# EAGLE design tappytap_v6_AoA_6x6 (EAGLE 7.3.0)
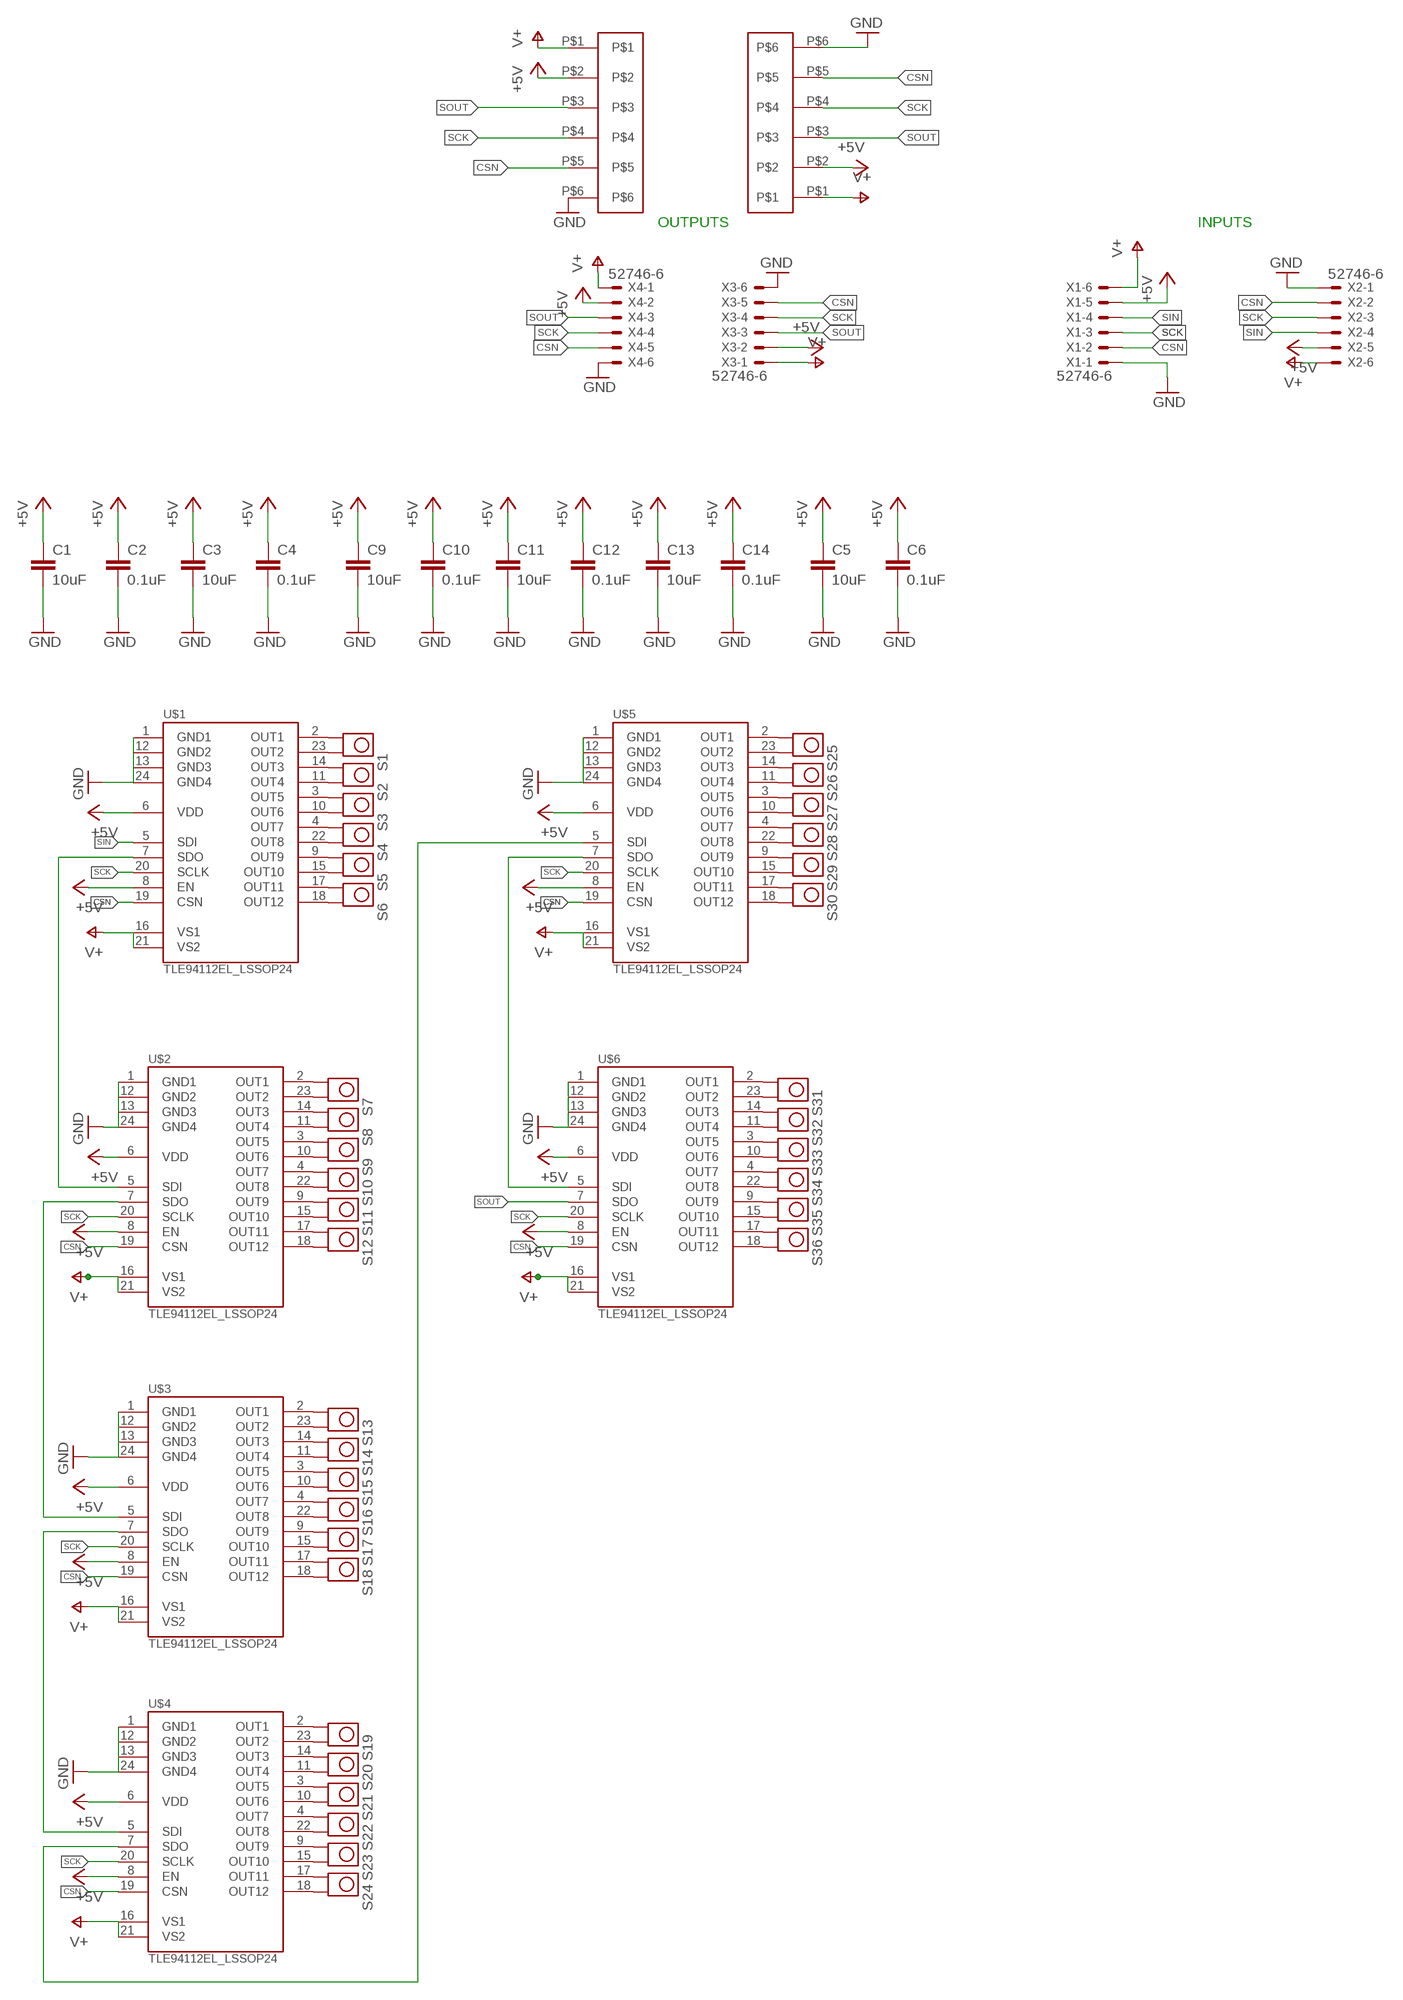
[diagram p0: schematic, sheet 1]

## Parts
C1  10uF  C-EUC0603  [C0603]
C2  0.1uF  C-EUC0603  [C0603]
C3  10uF  C-EUC0603  [C0603]
C4  0.1uF  C-EUC0603  [C0603]
C5  10uF  C-EUC0603  [C0603]
C6  0.1uF  C-EUC0603  [C0603]
C9  10uF  C-EUC0603  [C0603]
C10  0.1uF  C-EUC0603  [C0603]
C11  10uF  C-EUC0603  [C0603]
C12  0.1uF  C-EUC0603  [C0603]
C13  10uF  C-EUC0603  [C0603]
C14  0.1uF  C-EUC0603  [C0603]
S1  TP_4MM_MED_PAD  [TP_4MM_MED_PAD]
S2  TP_4MM_MED_PAD  [TP_4MM_MED_PAD]
S3  TP_4MM_MED_PAD  [TP_4MM_MED_PAD]
S4  TP_4MM_MED_PAD  [TP_4MM_MED_PAD]
S5  TP_4MM_MED_PAD  [TP_4MM_MED_PAD]
S6  TP_4MM_MED_PAD  [TP_4MM_MED_PAD]
S7  TP_4MM_MED_PAD  [TP_4MM_MED_PAD]
S8  TP_4MM_MED_PAD  [TP_4MM_MED_PAD]
S9  TP_4MM_MED_PAD  [TP_4MM_MED_PAD]
S10  TP_4MM_MED_PAD  [TP_4MM_MED_PAD]
S11  TP_4MM_MED_PAD  [TP_4MM_MED_PAD]
S12  TP_4MM_MED_PAD  [TP_4MM_MED_PAD]
S13  TP_4MM_MED_PAD  [TP_4MM_MED_PAD]
S14  TP_4MM_MED_PAD  [TP_4MM_MED_PAD]
S15  TP_4MM_MED_PAD  [TP_4MM_MED_PAD]
S16  TP_4MM_MED_PAD  [TP_4MM_MED_PAD]
S17  TP_4MM_MED_PAD  [TP_4MM_MED_PAD]
S18  TP_4MM_MED_PAD  [TP_4MM_MED_PAD]
S19  TP_4MM_MED_PAD  [TP_4MM_MED_PAD]
S20  TP_4MM_MED_PAD  [TP_4MM_MED_PAD]
S21  TP_4MM_MED_PAD  [TP_4MM_MED_PAD]
S22  TP_4MM_MED_PAD  [TP_4MM_MED_PAD]
S23  TP_4MM_MED_PAD  [TP_4MM_MED_PAD]
S24  TP_4MM_MED_PAD  [TP_4MM_MED_PAD]
S25  TP_4MM_MED_PAD  [TP_4MM_MED_PAD]
S26  TP_4MM_MED_PAD  [TP_4MM_MED_PAD]
S27  TP_4MM_MED_PAD  [TP_4MM_MED_PAD]
S28  TP_4MM_MED_PAD  [TP_4MM_MED_PAD]
S29  TP_4MM_MED_PAD  [TP_4MM_MED_PAD]
S30  TP_4MM_MED_PAD  [TP_4MM_MED_PAD]
S31  TP_4MM_MED_PAD  [TP_4MM_MED_PAD]
S32  TP_4MM_MED_PAD  [TP_4MM_MED_PAD]
S33  TP_4MM_MED_PAD  [TP_4MM_MED_PAD]
S34  TP_4MM_MED_PAD  [TP_4MM_MED_PAD]
S35  TP_4MM_MED_PAD  [TP_4MM_MED_PAD]
S36  TP_4MM_MED_PAD  [TP_4MM_MED_PAD]
U$1  TLE94112EL_LSSOP24  [SSOP-24]
U$2  TLE94112EL_LSSOP24  [SSOP-24]
U$3  TLE94112EL_LSSOP24  [SSOP-24]
U$4  TLE94112EL_LSSOP24  [SSOP-24]
U$5  TLE94112EL_LSSOP24  [SSOP-24]
U$6  TLE94112EL_LSSOP24  [SSOP-24]
U$15  FLEXTAB_6POS  [FLEXTAB_6POS]
U$16  FLEXTAB_6POS  [FLEXTAB_6POS]
X1  52746-6  [52746-6]
X2  52746-6  [52746-6]
X3  52746-6  [52746-6]
X4  52746-6  [52746-6]

## Nets
+5V [usbvcc]: C1.1 C2.1 C3.1 C4.1 C5.1 C6.1 C9.1 C10.1 C11.1 C12.1 C13.1 C14.1 U$1.6(VDD) U$1.8(EN) U$2.6(VDD) U$2.8(EN) U$3.6(VDD) U$3.8(EN) U$4.6(VDD) U$4.8(EN) U$5.6(VDD) U$5.8(EN) U$6.6(VDD) U$6.8(EN) U$15.P$2 U$16.P$2 X1.5 X2.5 X3.2 X4.2
CSN: U$1.19(CSN) U$2.19(CSN) U$3.19(CSN) U$4.19(CSN) U$5.19(CSN) U$6.19(CSN) U$15.P$5 U$16.P$5 X1.2 X2.2 X3.5 X4.5
GND [gnd]: C1.2 C2.2 C3.2 C4.2 C5.2 C6.2 C9.2 C10.2 C11.2 C12.2 C13.2 C14.2 U$1.1(GND1) U$1.12(GND2) U$1.13(GND3) U$1.24(GND4) U$2.1(GND1) U$2.12(GND2) U$2.13(GND3) U$2.24(GND4) U$3.1(GND1) U$3.12(GND2) U$3.13(GND3) U$3.24(GND4) U$4.1(GND1) U$4.12(GND2) U$4.13(GND3) U$4.24(GND4) U$5.1(GND1) U$5.12(GND2) U$5.13(GND3) U$5.24(GND4) U$6.1(GND1) U$6.12(GND2) U$6.13(GND3) U$6.24(GND4) U$15.P$6 U$16.P$6 X1.1 X2.1 X3.6 X4.6
N$1: S19.P$1 U$4.2(OUT1)
N$2: U$3.7(SDO) U$4.5(SDI)
N$3: S19.P$2 U$4.23(OUT2)
N$4: S20.P$1 U$4.14(OUT3)
N$5: S20.P$2 U$4.11(OUT4)
N$6: S21.P$1 U$4.3(OUT5)
N$7: S1.P$1 U$1.2(OUT1)
N$8: S1.P$2 U$1.23(OUT2)
N$9: S2.P$1 U$1.14(OUT3)
N$10: S2.P$2 U$1.11(OUT4)
N$11: S3.P$1 U$1.3(OUT5)
N$12: S3.P$2 U$1.10(OUT6)
N$13: S4.P$1 U$1.4(OUT7)
N$14: S4.P$2 U$1.22(OUT8)
N$15: S5.P$1 U$1.9(OUT9)
N$16: S5.P$2 U$1.15(OUT10)
N$17: S6.P$1 U$1.17(OUT11)
N$18: S6.P$2 U$1.18(OUT12)
N$19: S7.P$1 U$2.2(OUT1)
N$20: S7.P$2 U$2.23(OUT2)
N$21: S8.P$1 U$2.14(OUT3)
N$22: S8.P$2 U$2.11(OUT4)
N$23: S9.P$1 U$2.3(OUT5)
N$24: S21.P$2 U$4.10(OUT6)
N$25: S9.P$2 U$2.10(OUT6)
N$26: S22.P$1 U$4.4(OUT7)
N$27: S10.P$1 U$2.4(OUT7)
N$28: S10.P$2 U$2.22(OUT8)
N$29: S11.P$1 U$2.9(OUT9)
N$30: S11.P$2 U$2.15(OUT10)
N$31: S12.P$1 U$2.17(OUT11)
N$32: S12.P$2 U$2.18(OUT12)
N$33: S13.P$1 U$3.2(OUT1)
N$34: S13.P$2 U$3.23(OUT2)
N$35: S14.P$1 U$3.14(OUT3)
N$36: S14.P$2 U$3.11(OUT4)
N$37: S15.P$1 U$3.3(OUT5)
N$38: S15.P$2 U$3.10(OUT6)
N$39: S16.P$1 U$3.4(OUT7)
N$40: S16.P$2 U$3.22(OUT8)
N$41: S17.P$1 U$3.9(OUT9)
N$42: S17.P$2 U$3.15(OUT10)
N$43: S18.P$1 U$3.17(OUT11)
N$44: S18.P$2 U$3.18(OUT12)
N$45: U$2.7(SDO) U$3.5(SDI)
N$46: U$1.7(SDO) U$2.5(SDI)
N$47: S22.P$2 U$4.22(OUT8)
N$48: S23.P$1 U$4.9(OUT9)
N$49: S23.P$2 U$4.15(OUT10)
N$50: S24.P$1 U$4.17(OUT11)
N$51: S24.P$2 U$4.18(OUT12)
N$53: U$4.7(SDO) U$5.5(SDI)
N$54: S25.P$1 U$5.2(OUT1)
N$55: S25.P$2 U$5.23(OUT2)
N$56: S26.P$1 U$5.14(OUT3)
N$57: S26.P$2 U$5.11(OUT4)
N$58: S27.P$1 U$5.3(OUT5)
N$59: S27.P$2 U$5.10(OUT6)
N$60: S28.P$1 U$5.4(OUT7)
N$61: S28.P$2 U$5.22(OUT8)
N$62: S29.P$1 U$5.9(OUT9)
N$63: S29.P$2 U$5.15(OUT10)
N$64: S30.P$1 U$5.17(OUT11)
N$65: S30.P$2 U$5.18(OUT12)
N$66: S31.P$1 U$6.2(OUT1)
N$67: S31.P$2 U$6.23(OUT2)
N$68: S32.P$1 U$6.14(OUT3)
N$69: S32.P$2 U$6.11(OUT4)
N$70: S33.P$1 U$6.3(OUT5)
N$71: S33.P$2 U$6.10(OUT6)
N$72: S34.P$1 U$6.4(OUT7)
N$73: S34.P$2 U$6.22(OUT8)
N$74: S35.P$1 U$6.9(OUT9)
N$75: S35.P$2 U$6.15(OUT10)
N$76: S36.P$1 U$6.17(OUT11)
N$77: S36.P$2 U$6.18(OUT12)
N$90: U$5.7(SDO) U$6.5(SDI)
SCK: U$1.20(SCLK) U$2.20(SCLK) U$3.20(SCLK) U$4.20(SCLK) U$5.20(SCLK) U$6.20(SCLK) U$15.P$4 U$16.P$4 X1.3 X2.3 X3.4 X4.4
SIN: U$1.5(SDI) X1.4 X2.4
SOUT: U$6.7(SDO) U$15.P$3 U$16.P$3 X3.3 X4.3
V+: U$1.16(VS1) U$1.21(VS2) U$2.16(VS1) U$2.21(VS2) U$3.16(VS1) U$3.21(VS2) U$4.16(VS1) U$4.21(VS2) U$5.16(VS1) U$5.21(VS2) U$6.16(VS1) U$6.21(VS2) U$15.P$1 U$16.P$1 X1.6 X2.6 X3.1 X4.1

## Notes on the sheet
- OUTPUTS | INPUTS

## Library data of the parts
C1-C6 C9-C14 = rcl:C-EU: CAPACITOR, European symbol
S1-S36 = tom-tap:TP_4MM_MED_PAD
U$1-U$6 = tom-tap:TLE94112EL_LSSOP24
U$15 U$16 = tom-tap:FLEXTAB_6POS
X1-X4 = con-molex:52746-6: FPC Connector ZIF for SMT 0.5mm Source: http://www.farnell.com/datasheets/73044.pdf [DWG. NO. (Sheet 1 OF 2) SD-52746-**17]; OC_FARNELL: unknown; OC_NEWARK: unknown

## Board
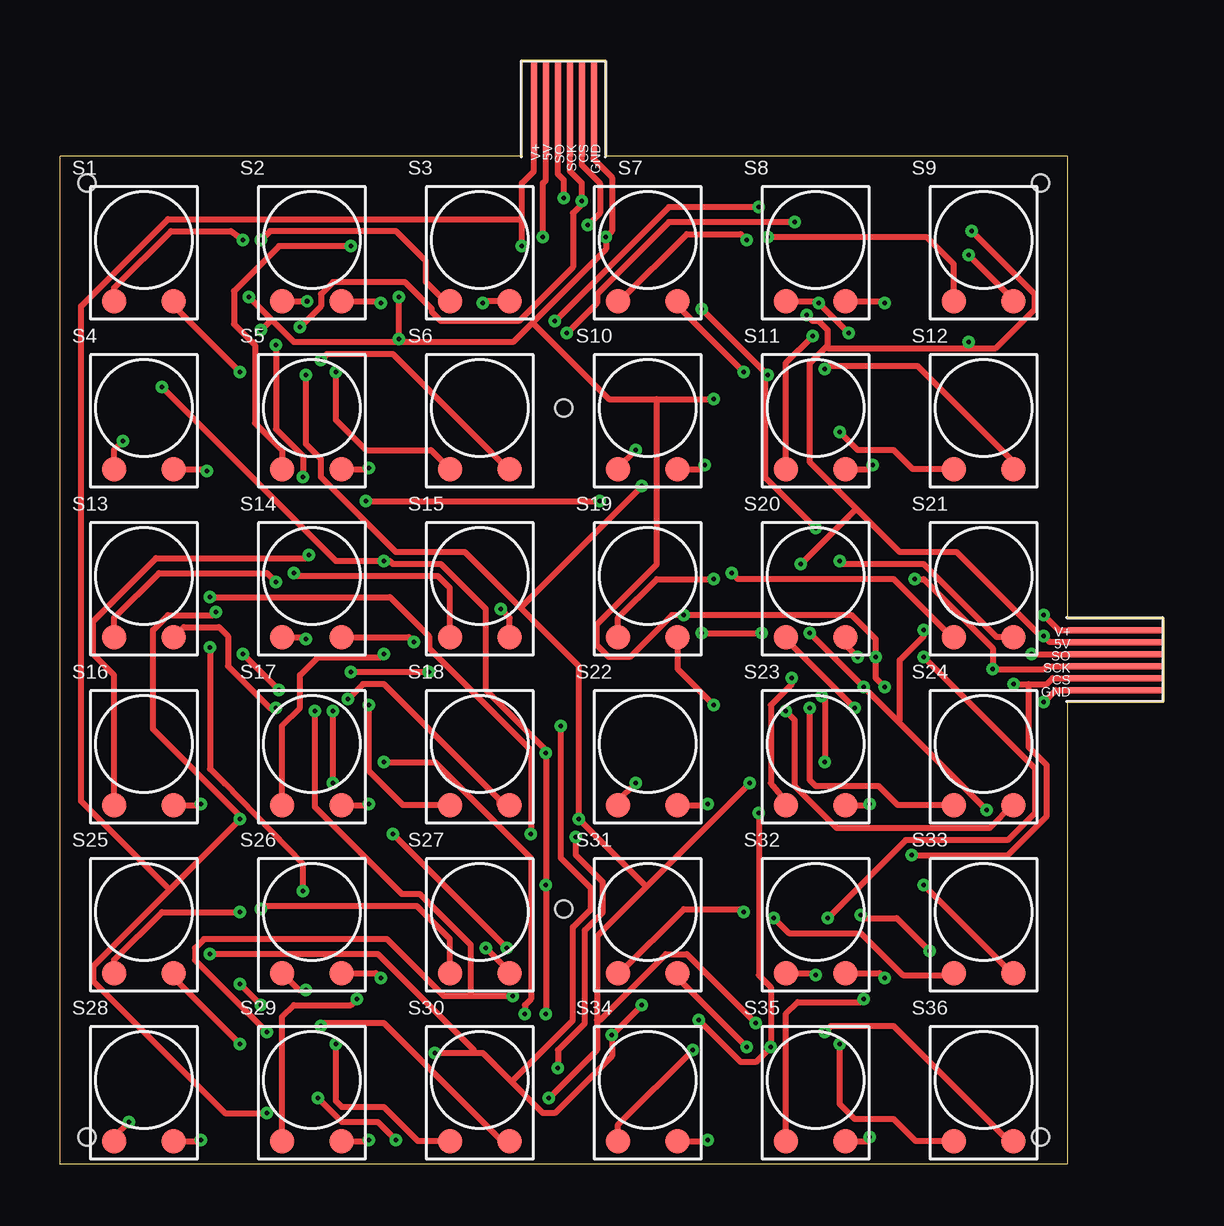
[diagram p1: board, top side]
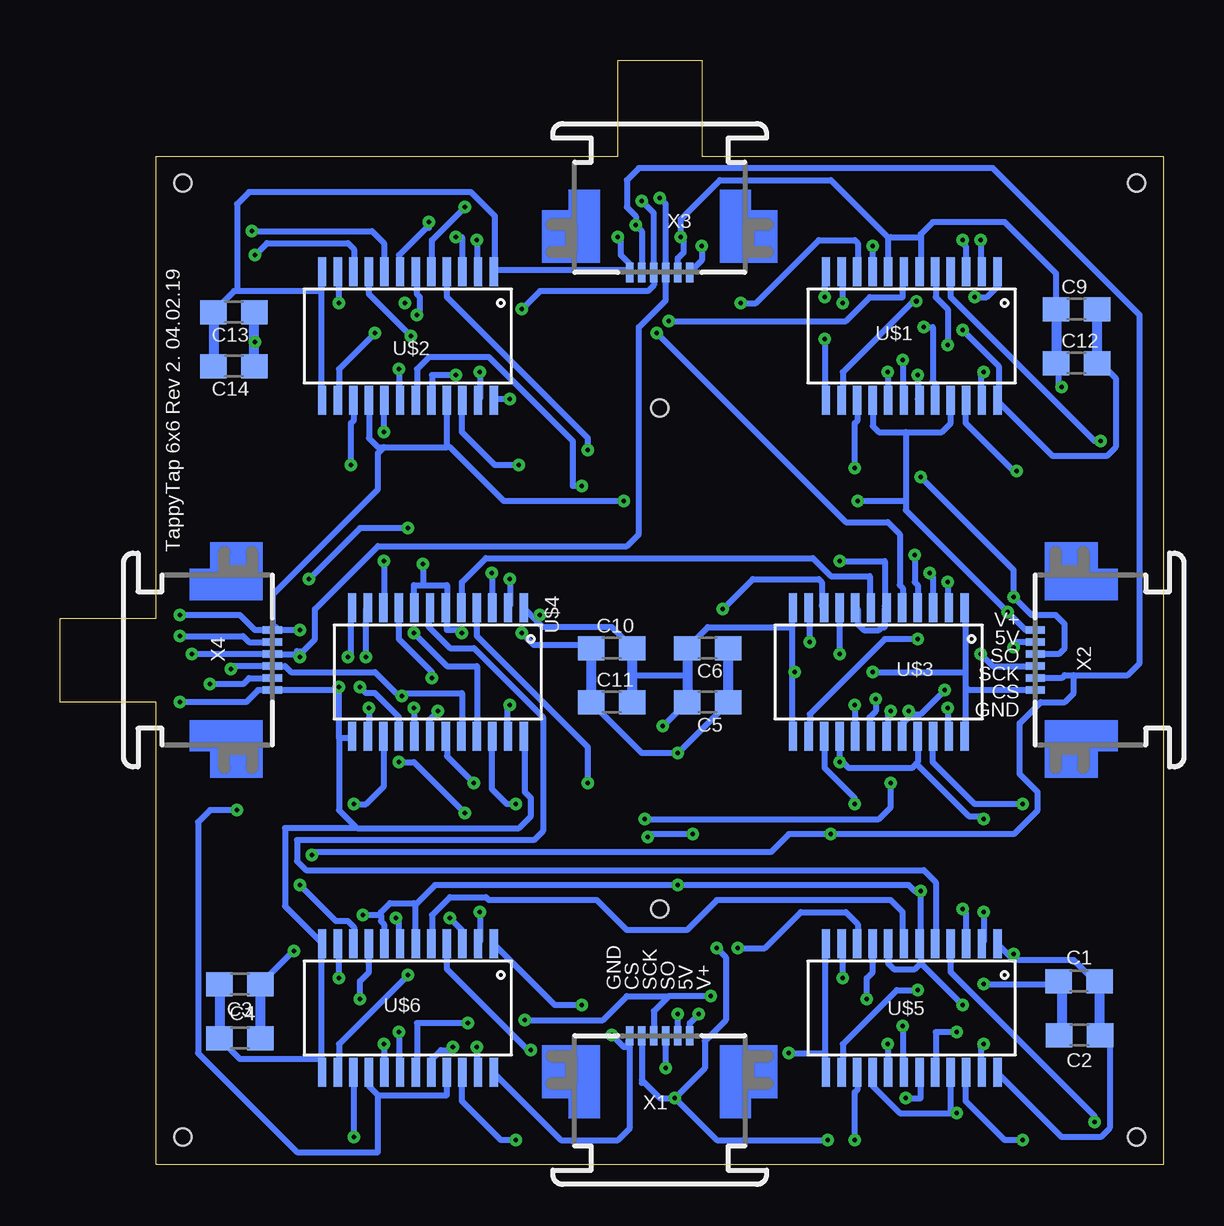
[diagram p2: board, bottom side, seen from below]

Size 46 x 46 mm. Coordinates in mm from the lower left corner, seen from the top.
Outline: 0,0 0,42 19.25,42 19.25,46 22.75,46 22.75,42 42,42 42,22.75 46,22.75 46,19.25 42,19.25 42,0 0,0
Copper layers (1*16): Top 0.035mm / dielectric 1.6mm / Bottom 0.035mm
Design rules "PCBWay *": minimum track width 8mil, minimum drill 0.2mm, track to track 6mil, track to pad 6mil, pad to pad 6mil, via to via 6mil, smd to smd 6mil, copper to edge 10mil, drill to drill 8mil, minimum pad ring 12mil, minimum via ring 6mil, stop-mask expansion 4mil, vias tented up to drill 25mil, thermal gap 10mil
Holes 0.7 mm at 1.12,40.88 40.88,40.88 40.88,1.12 1.12,1.12 21,31.5 21,10.62

### Footprints (pad centres in the part's own frame; a part is rotated, then mirrored left to right if it is on the bottom)
C0603 = smd 1.1 x 1: 1 -0.85,0; 2 0.85,0
TP_4MM_MED_PAD = smd 1.016 x 1.016: P$1 -1.24,-2.55; P$2 1.24,-2.55
SSOP-24 = smd 1.2 x 0.35: 1 -2.68,3.575; 2 -2.68,2.925; 3 -2.68,2.275; 4 -2.68,1.625; 5 -2.68,0.975; 6 -2.68,0.325; 7 -2.68,-0.325; 8 -2.68,-0.975; 9 -2.68,-1.625; 10 -2.68,-2.275; 11 -2.68,-2.925; 12 -2.68,-3.575; 13 2.68,-3.575; 14 2.68,-2.925; 15 2.68,-2.275; 16 2.68,-1.625; 17 2.68,-0.975; 18 2.68,-0.325; 19 2.68,0.325; 20 2.68,0.975; 21 2.68,1.625; 22 2.68,2.275; 23 2.68,2.925; 24 2.68,3.575
FLEXTAB_6POS = smd 0.25 x 4: P$1 -1.25,2; P$2 -0.75,2; P$3 -0.25,2; P$4 0.25,2; P$5 0.75,2; P$6 1.25,2
52746-6 = smd 0.3 x 0.8: 1 -1.25,0.6; 2 -0.75,0.6; 3 -0.25,0.6; 4 0.25,0.6; 5 0.75,0.6; 6 1.25,0.6

### Placement (x,y rotation side)
C1  3.52,7.62 0 bottom
C2  3.5,5.38 0 bottom
C3  38.5,7.5 180 bottom
C4  38.5,5.25 180 bottom
C5  19,19.25 180 bottom
C6  19,21.5 180 bottom
C9  3.62,35.62 0 bottom
C10  23,21.5 0 bottom
C11  23,19.25 0 bottom
C12  3.62,33.38 0 bottom
C13  38.75,35.5 180 bottom
C14  38.75,33.25 180 bottom
S1  3.5,38.5 0 top
S2  10.5,38.5 0 top
S3  17.5,38.5 0 top
S4  3.5,31.5 0 top
S5  10.5,31.5 0 top
S6  17.5,31.5 0 top
S7  24.5,38.5 0 top
S8  31.5,38.5 0 top
S9  38.5,38.5 0 top
S10  24.5,31.5 0 top
S11  31.5,31.5 0 top
S12  38.5,31.5 0 top
S13  3.5,24.5 0 top
S14  10.5,24.5 0 top
S15  17.5,24.5 0 top
S16  3.5,17.5 0 top
S17  10.5,17.5 0 top
S18  17.5,17.5 0 top
S19  24.5,24.5 0 top
S20  31.5,24.5 0 top
S21  38.5,24.5 0 top
S22  24.5,17.5 0 top
S23  31.5,17.5 0 top
S24  38.5,17.5 0 top
S25  3.5,10.5 0 top
S26  10.5,10.5 0 top
S27  17.5,10.5 0 top
S28  3.5,3.5 0 top
S29  10.5,3.5 0 top
S30  17.5,3.5 0 top
S31  24.5,10.5 0 top
S32  31.5,10.5 0 top
S33  38.5,10.5 0 top
S34  24.5,3.5 0 top
S35  31.5,3.5 0 top
S36  38.5,3.5 0 top
U$1  10.5,34.5 270 bottom
U$2  31.5,34.5 270 bottom
U$3  11.88,20.5 270 bottom
U$4  30.25,20.5 270 bottom
U$5  10.5,6.5 270 bottom
U$6  31.5,6.5 270 bottom
U$15  21,42 0 top
U$16  42,21 270 top
X1  21,4.75 0 bottom
X2  4.75,21 90 bottom
X3  21,37.75 180 bottom
X4  37.75,21 270 bottom

### Tracks (layer width: path | path; a pad name or v marks a point on that pad's centre or on a via)
+5V  (via drill 0.2, 0.2 pad 0.1)
  Top 0.254: v20.12,38.62 20.12,40.88 20.25,41 U$15.P$2 20.25,43.81 | U$16.P$2 41.25,21.75 v41,22 40.88,22 37.38,25.5 35,25.5 33.19,27.31 | v10.12,11.38 10.12,12.5 6.86,15.86 6.25,16.47 v6.25,21.52 | v8.38,6.62 v7.5,7.5 | v31.12,35.38 31.38,35.12 31.62,35.12 32,34.75 32,34.12 | 32,34.12 31.25,33.38 31.25,29.25 33.19,27.31 | v38,38.88 40.62,36.25 40.62,35.62 39,34 37.88,34 | 37.88,34 32,34 32,34.12 | 33.19,27.31 v30.88,25 | v37.88,34.25 37.88,34 | v20.25,6.25 v20.25,11.62 v20.25,17.12 20.25,17.25 17.75,19.75 17.75,23.12 15.88,25 13.88,25 13.75,25.12 v13.5,25.12 11.5,25.12 v4.25,32.38 | v26.75,22.12 v29.25,22.12 | v33.38,10.38 33.38,10.25 34.88,10.25 v36.25,8.88
  Bottom 0.254: v41,22 38.38,22 38.12,21.75 X4.2 | X3.2 20.25,37.75 20,38 20,38.5 v20.12,38.62 20.12,39.38 18.5,41 13.88,41 11.5,38.62 11.38,38.62 | C9.1 4.47,37.1 6.62,39.25 9.62,39.25 10.12,38.75 10.12,38.62 | 10.12,38.62 10.12,37.23 U$1.6 | U$1.8 11.47,38.52 11.38,38.62 | 11.38,38.62 10.12,38.62 | 31.25,10.88 32.25,10.88 32.62,10.5 32.62,10.38 | 31.25,10.88 31.12,10.88 30.38,11.62 v20.25,11.62 10.62,11.62 10.38,11.38 v10.12,11.38 10.12,9.25 U$5.6 10.12,9.12 10.12,8.38 | 32.62,10.38 v33.38,10.38 | v7.5,7.5 4.5,7.5 C1.1 | 10.12,8.38 v8.38,6.62 | 30.88,24.12 29.88,24.12 29.88,23.25 U$4.6 29.88,23.12 29.88,22.25 29.38,22.25 v29.25,22.12 | 30.88,24.12 31.25,24.12 31.25,23.25 U$4.8 | v31.12,35.38 31,35.38 31,36.12 31.12,36.25 31.12,37.12 U$2.6 | v38,38.88 33,38.88 32.5,38.38 32.5,37.25 U$2.8 | v30.88,25 30.88,24.12 | v37.88,34.25 37.9,34.25 | U$3.8 12.75,23.12 12.75,22.5 12.5,22.25 11.88,22.25 11.75,22.38 11.62,22.38 11.62,23.12 U$3.6 11.62,23.25 11.62,25.12 v13.5,25.12 | C5.1 18.25,19.12 v20.25,17.12 21.75,17.12 23.75,19.12 C11.1 | v4.25,32.38 4.38,32.38 4.38,33.25 C12.1 | v26.75,22.12 26.25,21.62 24,21.62 C10.1 | U$5.8 11.47,8.35 11.25,8.12 10.38,8.12 10.12,8.38 | 37.15,8 C3.1 36.27,8.88 v36.25,8.88 | U$6.6 31.18,10.8 31.25,10.88 | 32.62,10.38 32.62,10.12 32.5,10 32.5,9.21 U$6.8 | X1.5 v20.25,6.25 | X2.5 6.15,21.75 v6.25,21.52
  Bottom 0.406: C9.1 C12.1 | C14.1 37.9,34.25 C13.1 | C6.1 C5.1 | C11.1 C10.1 | C3.1 C4.1 | C1.1 4.25,7.62 4.25,5.47 C2.1
CSN  (via drill 0.2, 0.2 pad 0.1)
  Top 0.254: v10.75,2.75 11.75,1.75 13.25,1.75 v14,1 | v20.38,2.75 22.38,4.75 22.38,6 | 22.38,6 22.38,9.5 24.44,11.56 | v28.75,15.88 24.44,11.56 | v11.38,15.88 v11.38,18.88 | 24.44,11.56 v21.62,14.38 21.62,20.75 19.19,23.19 | v10.25,32.88 10.25,30 10.88,29.38 10.88,28.62 14,25.5 16.88,25.5 19.19,23.19 | v29,5.88 26.12,8.75 25.25,8.75 22.5,6 22.38,6 | 19.19,23.19 v24.25,28.25 | v22,39.12 22.5,39.62 22.5,40.88 21.75,41.62 U$15.P$5 21.75,43.88 | v39.75,20 40.38,20 | 40.38,20 41.12,20 41.38,20.25 U$16.P$5 | v13.88,13.75 v18.62,9 | 40.38,20 40.38,17.38 41.12,16.62 41.12,14.5 39.5,12.88 v35.5,12.88
  Bottom 0.254: v10.75,2.75 10.12,2.75 10.12,3.75 U$5.19 | v14,1 18.62,1 v20.38,2.75 | v28.75,15.88 29.88,17 29.88,17.75 U$4.19 | v11.38,18.88 11.5,18.88 11.5,17.88 U$3.19 | v21.62,14.38 11.88,14.38 11.38,14.88 v11.38,15.88 | v10.25,32.88 10.25,31.88 U$1.19 | v29,5.88 31.12,5.88 31.12,3.88 U$6.19 | v24.25,28.25 24.62,28.25 24.62,30.12 28.12,33.62 30.62,33.62 31.12,33.12 31.12,31.88 U$2.19 | v39.75,20 38.38,20 38.12,20.25 X4.5 | v18.62,9 18.25,8.62 18.25,6 19.12,5.12 19.12,4 v20.38,2.75 | v35.5,12.88 35.38,13 16.38,13 15.62,13.75 v13.88,13.75 6.25,13.75 5.25,14.75 5.25,15.5 6,16.25 6,18.38 5.12,19.25 4.12,19.25 3.75,19.62 3.75,20.38 | 3.75,20.38 4.12,20.38 4.25,20.25 X2.2 | 3.75,20.38 1.5,20.38 1,20.88 1,35.38 7.12,41.5 21.88,41.5 22.38,41 22.38,39.88 22,39.5 v22,39.12 21.75,38.88 X3.5 | X1.2 21.75,3.5 | 21.75,3.5 21.75,3.38 | 21.75,3.5 21,2.75 v20.38,2.75
GND  (via drill 0.2, 0.2 pad 0.1)
  Top 0.254: U$15.P$6 22.23,41.9 23,41.12 23,38.88 v22.75,38.62 22.75,38.12 19.69,35.06 | U$16.P$6 41.5,19.75 v41,19.25 | 8.81,35.19 9.75,34.25 14.12,34.25 | 8.81,35.19 v7.88,36.12 | 14.12,34.25 18.88,34.25 19.69,35.06 | 14.12,34.25 v14.12,34.38 v14.12,36.12 | 24.88,31.88 22.88,31.88 19.69,35.06 | 24.88,31.88 v27.25,31.88 | 8.81,35.19 v8.38,34.75 | v24.25,6.62 v23,5.38 23,4.5 20.62,2.12 20.12,2.12 18.81,3.44 | 17.25,4.62 17.62,4.62 18.81,3.44 | 17.25,4.62 v15.62,4.62 | v6.25,8.75 13.25,8.75 17.25,4.75 17.25,4.62 | v15.38,20.5 v12.12,20.5 | v34.38,19.88 34,20.25 v34,21.12 34,21.88 33,22.88 v26,22.88 25.5,22.88 23.75,21.12 22.88,21.12 22.38,21.62 22.38,22.5 24.88,25 24.88,31.88 | 18.81,3.44 21.38,6 21.38,9.88 22.12,10.62 22.12,11.5 20.88,12.75 v20.88,18.25
  Bottom 0.254: v41,19.25 38.25,19.25 37.75,19.75 X4.6 34.5,19.75 v34.38,19.88 34.38,17.75 | v22.75,38.62 22.62,38.5 22.62,37.88 22.25,37.5 X3.6 22.38,37.25 27.88,37.25 U$2.1 27.88,37.38 27.88,39.5 28.88,40.5 38.12,40.5 38.62,40 38.62,36.38 | 35.12,36.38 35.12,37.12 U$2.12 | 35.12,36.38 35.12,31.88 U$2.13 | 35.12,36.38 38.62,36.38 | 38.62,36.38 38.75,36.38 39.5,35.62 C13.2 | C12.2 2.62,33.25 2.5,33.25 2,32.75 2,29.88 2.38,29.5 4.62,29.5 6.88,31.75 U$1.24 6.88,31.88 6.88,33.25 v8.38,34.75 | v7.88,36.12 7.38,36.12 6.88,36.62 6.88,37.12 U$1.1 | v14.12,34.38 14.12,31.88 U$1.13 | v14.12,36.12 14.12,37.12 U$1.12 | v27.25,31.88 27.88,31.88 U$2.24 | U$5.24 6.88,3.75 4.25,1.12 2.62,1.12 2.25,1.5 2.25,5.25 2.5,5.25 C2.2 | 6.44,8.69 6.25,8.5 3.75,8.5 2.88,7.62 C1.2 | 6.44,8.69 6.88,9.12 U$5.1 | 14.12,4.62 14.12,9.12 U$5.12 | 14.12,4.62 14.12,3.88 U$5.13 | U$6.24 27.88,3.75 25.12,1 22.75,1 22.25,1.5 X1.1 22.38,4.88 22.5,4.88 v23,5.38 | v24.25,6.62 25.38,6.62 27.88,9.12 U$6.1 | v15.62,4.62 14.12,4.62 | v6.25,8.75 6.38,8.75 6.44,8.69 | 8.25,17.88 U$3.24 8.25,18 8.25,19.88 | 8.25,19.88 8.25,20.5 | 8.25,20.5 8.25,23.12 U$3.1 | 15.5,22.38 15.5,23.12 U$3.12 | 15.5,22.38 15.5,20.5 | 15.5,20.5 15.5,17.88 U$3.13 | 26.19,22.69 25.88,22.38 23,22.38 22.25,21.62 C10.2 | 26.19,22.69 26.62,23.12 U$4.1 | 22.15,20.38 19.85,20.38 | 15.5,22.38 19,22.38 19.75,21.62 C6.2 | v12.12,20.5 8.25,20.5 | v15.38,20.5 15.5,20.5 | C4.2 39.25,5.12 38.5,4.38 35.12,4.38 U$6.13 35.12,3.88 35.12,9.12 U$6.12 35.12,9.25 36.62,10.75 36.62,14 33.62,14 | 33.62,14 26.88,14 26.38,14.5 26.38,15.25 26.62,15.5 26.62,17.75 U$4.24 | 33.62,14 34.38,14.75 34.38,17.75
  Bottom 0.254: 34.38,17.75 33.88,17.75 U$4.13 | v34,21.12 33.88,21.12 33.88,23.12 U$4.12 | v26,22.88 26.19,22.69 | v20.88,18.25 20,19.12 C5.2 | X2.1 8.12,19.75 8.25,19.88
  Bottom 0.406: C9.2 C12.2 | C13.2 C14.2 | C6.2 19.85,20.38 C5.2 | C10.2 22.15,20.38 C11.2 | C3.2 C4.2 | C1.2 2.67,5.4 C2.2
N$1  (via drill 0.2)
  Top 0.254: S19.P$1 23.26,22.76 24.88,24.38 v27.25,24.38
  Bottom 0.254: v27.25,24.38 27.25,23.25 U$4.2
N$2
  Bottom 0.254: U$3.7 12.25,23.25 12.25,24.5 13.88,24.5 14.62,25.25 28.25,25.25 29.25,24.25 29.25,23.25 U$4.5
N$3  (via drill 0.2)
  Top 0.254: S19.P$2 25.74,20.64 v27.25,19.12
  Bottom 0.254: v27.25,19.12 27.38,19 27.38,17.87 U$4.23
N$4  (via drill 0.2)
  Top 0.254: S20.P$1 30.26,21.86 v33.12,19
  Bottom 0.254: v33.12,19 33.12,17.87 U$4.14
N$5  (via drill 0.2)
  Top 0.254: S20.P$2 32.74,21.64 v33.25,21.12
  Bottom 0.254: v33.25,21.12 33.25,23.11 U$4.11
N$6  (via drill 0.2)
  Top 0.254: S21.P$1 37.17,21.95 34.75,24.38 28.25,24.38 v28,24.62
  Bottom 0.254: v28,24.62 28,23.2 U$4.3
N$7  (via drill 0.2)
  Top 0.254: S1.P$1 2.26,36.51 4.62,38.88 7.12,38.88 v7.62,38.5
  Bottom 0.254: v7.62,38.5 7.62,37.26 U$1.2
N$8  (via drill 0.2)
  Top 0.254: S1.P$2 4.74,35.76 v7.5,33
  Bottom 0.254: v7.5,33 7.62,32.88 7.62,31.87 U$1.23
N$9  (via drill 0.2)
  Top 0.254: S2.P$1 v10.3,35.95
  Bottom 0.254: v10.3,35.95 10.43,35.95 13.38,33 13.38,31.87 U$1.14
N$10  (via drill 0.2)
  Top 0.254: S2.P$2 13.3,35.95 v13.38,35.88
  Bottom 0.254: v13.38,35.88 13.38,37.1 U$1.11
N$11  (via drill 0.2)
  Top 0.254: S3.P$1 16.05,35.95 15.25,36.75 15.25,37.62 14,38.88 8.75,38.88 v8.38,38.5
  Bottom 0.254: v8.38,38.5 8.38,38.38 8.25,38.25 8.25,37.2 U$1.3
N$12  (via drill 0.2)
  Top 0.254: S3.P$2 17.7,35.95 v17.62,35.88
  Bottom 0.254: v17.62,35.88 17,35.88 14.38,38.5 12.88,38.5 12.75,38.38 12.75,37.2 U$1.10
N$13  (via drill 0.2)
  Top 0.254: S4.P$1 2.26,29.76 v2.62,30.12
  Bottom 0.254: v2.62,30.12 2.88,30.12 8.88,36.12 U$1.4
N$14  (via drill 0.2)
  Top 0.254: S4.P$2 6.05,28.95 v6.12,28.88
  Bottom 0.254: U$1.22 8.25,31.8 8.25,30.88 6.25,28.88 v6.12,28.88
N$15  (via drill 0.2)
  Top 0.254: v12.12,38.25 9.12,38.25 7.25,36.38 7.25,35 8.12,34.12 8.12,30.88 9.25,29.75 9.25,29 S5.P$1
  Bottom 0.254: U$1.9 v12.12,38.25
N$16  (via drill 0.2)
  Top 0.254: S5.P$2 12.82,28.95 v12.88,29
  Bottom 0.254: v12.88,29 12.88,30.88 12.75,31 12.75,31.8 U$1.15
N$17  (via drill 0.2)
  Top 0.254: v11.5,33 11.5,31 12.75,29.75 15.46,29.75 S6.P$1
  Bottom 0.254: v11.5,33 11.5,31.84 U$1.17
N$18  (via drill 0.2)
  Top 0.254: S6.P$2 18.68,28.95 13.88,33.75 11.12,33.75 v10.88,33.5
  Bottom 0.254: v10.88,33.5 10.88,31.87 U$1.18
N$19  (via drill 0.2)
  Top 0.254: S7.P$1 23.32,35.95 26.12,38.75 28.38,38.75 v28.62,38.5
  Bottom 0.254: v28.62,38.5 28.62,37.23 U$2.2
N$20  (via drill 0.2)
  Top 0.254: S7.P$2 25.74,35.76 v28.5,33
  Bottom 0.254: v28.5,33 28.5,31.89 U$2.23
N$21  (via drill 0.2)
  Top 0.254: S8.P$1 31.55,35.95 v31.62,35.88 v32.88,34.62
  Bottom 0.254: v31.62,35.88 31.5,35.88 | U$2.14 34.38,31.87 34.38,33.12 v32.88,34.62
N$22  (via drill 0.2)
  Top 0.254: S8.P$2 34.42,35.95 v34.38,35.88
  Bottom 0.254: v34.38,35.88 34.38,37.1 U$2.11
N$23  (via drill 0.2)
  Top 0.254: S9.P$1 37.26,37.49 36.12,38.62 v29.5,38.62
  Bottom 0.254: v29.5,38.62 29.25,38.62 29.25,37.2 U$2.3
N$24  (via drill 0.2)
  Top 0.254: S21.P$2 39.05,21.95 36,25 32.62,25 v32.5,25.12
  Bottom 0.254: v32.5,25.12 32.5,23.2 U$4.10
N$25  (via drill 0.2)
  Top 0.254: S9.P$2 39.74,36.01 v37.88,37.88
  Bottom 0.254: v37.88,37.88 37.38,38.38 34,38.38 33.75,38.12 33.75,37.2 U$2.10
N$26  (via drill 0.2)
  Top 0.254: S22.P$1 23.26,15.13 v24,15.88
  Bottom 0.254: v24,15.88 24,17.38 28.62,22 U$4.4
N$27  (via drill 0.2)
  Top 0.254: S10.P$1 23.26,29.01 v24,29.75
  Bottom 0.254: v24,29.75 24,30.25 29.88,36.12 U$2.4
N$28  (via drill 0.2)
  Top 0.254: S10.P$2 26.7,28.95 v26.88,29.12
  Bottom 0.254: v26.88,29.12 27.88,29.12 29.25,30.5 29.25,31.8 U$2.22
N$29  (via drill 0.2)
  Top 0.254: S11.P$1 30.26,33.38 v31.38,34.5
  Bottom 0.254: v31.38,34.5 33.12,36.25 U$2.9
N$30  (via drill 0.2)
  Top 0.254: S11.P$2 33.7,28.95 v33.88,29.12
  Bottom 0.254: v33.88,29.12 33.88,30.88 33.75,31 33.75,31.8 U$2.15
N$31  (via drill 0.2)
  Top 0.254: S12.P$1 35.55,28.95 34.75,29.75 33.25,29.75 v32.5,30.5
  Bottom 0.254: v32.5,30.5 32.5,31.8 U$2.17
N$32  (via drill 0.2)
  Top 0.254: S12.P$2 39.74,29.26 35.75,33.25 32,33.25 v31.88,33.12
  Bottom 0.254: v31.88,33.12 31.88,31.87 U$2.18
N$33  (via drill 0.2)
  Top 0.254: S13.P$1 2.26,22.76 4.12,24.62 8.62,24.62 v9,24.25
  Bottom 0.254: v9,24.25 9,23.23 U$3.2
N$34  (via drill 0.2)
  Top 0.254: S13.P$2 5.17,22.38 6.62,22.38 7,22 7,20.75 8.75,19 v9,19
  Bottom 0.254: v9,19 9,17.87 U$3.23
N$35  (via drill 0.2)
  Top 0.254: S14.P$1 10.18,21.95 v10.25,21.88
  Bottom 0.254: v10.25,21.88 11.62,21.88 14.75,18.75 14.75,17.87 U$3.14
N$36  (via drill 0.2)
  Top 0.254: S14.P$2 14.55,21.95 v14.75,21.75
  Bottom 0.254: v14.75,21.75 14.75,23.13 U$3.11
N$37  (via drill 0.2)
  Top 0.254: S15.P$1 16.26,23.99 15.75,24.5 9.88,24.5 v9.75,24.62
  Bottom 0.254: v9.75,24.62 9.62,24.5 9.62,23.2 U$3.3
N$38  (via drill 0.2)
  Top 0.254: S15.P$2 18.74,22.76 v18.38,23.12
  Bottom 0.254: v18.38,23.12 17.12,24.38 14.38,24.38 14.25,24.25 14.25,23.28 U$3.10
N$39  (via drill 0.2)
  Top 0.254: S16.P$1 2.26,20.36 1.38,21.25 1.38,22.62 4,25.25 10.25,25.25 v10.38,25.38
  Bottom 0.254: v10.38,25.38 10.38,24.25 10.25,24.12 U$3.4
N$40  (via drill 0.2)
  Top 0.254: S16.P$2 5.83,14.95 v5.88,15
  Bottom 0.254: v5.88,15 7.88,15 9.62,16.75 9.62,17.8 U$3.22
N$41  (via drill 0.2)
  Top 0.254: S17.P$1 9.26,18.26 10,19 10,20.38 10.75,21.12 13.38,21.12 v13.5,21.25
  Bottom 0.254: v13.5,21.25 U$3.9
N$42  (via drill 0.2)
  Top 0.254: S17.P$2 12.82,14.95 v12.88,15
  Bottom 0.254: v12.88,15 12.88,15.25 14.12,16.5 14.12,17.8 U$3.15
N$43  (via drill 0.2)
  Top 0.254: S18.P$1 14.3,14.95 12.88,16.38 v12.88,19.12
  Bottom 0.254: v12.88,19.12 12.88,17.84 U$3.17
N$44  (via drill 0.2)
  Top 0.254: S18.P$2 18.32,14.95 18.32,15.18 13.5,20 12.62,20 v12,19.38
  Bottom 0.254: v12,19.38 12,18.88 12.25,18.62 12.25,17.87 U$3.18
N$45  (via drill 0.2)
  Top 0.254: v21.12,34.62 22.38,35.88 22.38,36.25 25.38,39.25 v30.62,39.25
  Bottom 0.254: v21.12,34.62 13.25,26.75 11.5,26.75 11,26.25 11,24.12 10.88,24 10.88,23.2 U$3.5 | v30.62,39.25 30.62,39 30.75,39 31.88,37.88 31.88,37.23 U$2.7
N$46  (via drill 0.2)
  Top 0.254: v20.62,35.12 25.38,39.88 v29.12,39.88
  Bottom 0.254: v20.62,35.12 13.25,35.12 12.25,36.12 10.88,36.12 10.88,37.12 U$1.7 | v29.12,39.88 30.5,38.5 30.5,37.25 U$2.5
N$47  (via drill 0.2)
  Top 0.254: S22.P$2 26.95,14.95 v27,15
  Bottom 0.254: v27,15 27.38,15 28,15.62 28,17.8 U$4.22
N$48  (via drill 0.2)
  Top 0.254: S23.P$1 30.26,15.12 29.62,15.88 29.62,19.12 30.5,20 v30.5,20.25
  Bottom 0.254: v30.5,20.25 30.5,20.5 31.88,21.88 U$4.9
N$49  (via drill 0.2)
  Top 0.254: S23.P$2 33.7,14.95 v33.75,15
  Bottom 0.254: v33.75,15 33.25,15 32.5,15.75 32.5,17.72 U$4.15
N$50  (via drill 0.2)
  Top 0.254: S24.P$1 34.92,14.95 34.12,15.75 31.5,15.75 31.25,16 v31.25,19
  Bottom 0.254: v31.25,19 31.25,17.84 U$4.17
N$51  (via drill 0.2)
  Top 0.254: S24.P$2 39.7,14.95 38.75,14 32.38,14 30.62,15.75 30.62,18.5 v30.25,18.88
  Bottom 0.254: v30.25,18.88 30.62,18.5 30.62,17.87 U$4.18
N$53
  Bottom 0.254: U$5.5 9.5,9.25 9.5,11.75 10,12.25 35.75,12.25 36.12,12.62 36.12,13.5 26.25,13.5 25.88,13.88 25.88,18.62 28.75,21.5 29.75,21.5 30.62,22.38 30.62,23.13 U$4.7
N$54  (via drill 0.2)
  Top 0.254: S25.P$1 2.26,8.51 4.25,10.5 v7.5,10.5
  Bottom 0.254: v7.5,10.5 7.5,9.26 U$5.2
N$55  (via drill 0.2)
  Top 0.254: S25.P$2 4.74,7.76 v7.5,5
  Bottom 0.254: v7.5,5 7.62,4.88 7.62,3.87 U$5.23
N$56  (via drill 0.2)
  Top 0.254: v10.25,7.25 9.96,7.25 S26.P$1
  Bottom 0.254: U$5.14 13.38,3.87 13.38,5 11.12,7.25 v10.25,7.25
N$57  (via drill 0.2)
  Top 0.254: S26.P$2 13.18,7.95 v13.38,7.75
  Bottom 0.254: v13.38,7.75 13.38,9.13 U$5.11
N$58  (via drill 0.2)
  Top 0.254: S27.P$1 16.26,9.37 14.88,10.75 8.5,10.75 v8.38,10.62
  Bottom 0.254: v8.38,10.62 8.25,10.5 8.25,9.21 U$5.3
N$59  (via drill 0.2)
  Top 0.254: S27.P$2 18.74,8.01 v17.75,9
  Bottom 0.254: v17.75,9 16.62,9 15.12,10.5 13.25,10.5 12.75,10 12.75,9.21 U$5.10
N$60  (via drill 0.2)
  Top 0.254: S28.P$1 2.26,1.14 v2.88,1.75
  Bottom 0.254: v2.88,1.75 2.88,2 8.88,8 U$5.4
N$61  (via drill 0.2)
  Top 0.254: S28.P$2 5.83,0.95 v5.88,1
  Bottom 0.254: v5.88,1 6.62,1 8.25,2.62 8.25,3.79 U$5.22
N$62  (via drill 0.2)
  Top 0.254: S29.P$1 9.26,6.13 9.75,6.62 12.12,6.62 v12.38,6.88
  Bottom 0.254: v12.38,6.88 12.38,7.75 12.12,8 U$5.9
N$63  (via drill 0.2)
  Top 0.254: S29.P$2 12.82,0.95 v12.88,1
  Bottom 0.254: v12.88,1 12.88,3 12.75,3.12 12.75,3.79 U$5.15
N$64  (via drill 0.2)
  Top 0.254: S30.P$1 14.93,0.95 13.5,2.38 11.75,2.38 11.5,2.62 v11.5,5
  Bottom 0.254: v11.5,5 11.5,3.85 U$5.17
N$65  (via drill 0.2)
  Top 0.254: S30.P$2 18.43,0.95 13.5,5.88 11,5.88 v10.88,5.75
  Bottom 0.254: v10.88,5.75 10.88,3.87 U$5.18
N$66  (via drill 0.2)
  Top 0.254: S31.P$1 23.32,7.95 26,10.62 28.38,10.62 v28.5,10.5
  Bottom 0.254: v28.5,10.5 28.5,9.26 U$6.2
N$67  (via drill 0.2)
  Top 0.254: S31.P$2 25.74,7.76 v28.62,4.88
  Bottom 0.254: v28.62,4.88 28.62,3.87 U$6.23
N$68  (via drill 0.2)
  Top 0.254: S32.P$1 31.43,7.95 v31.5,7.88
  Bottom 0.254: v31.5,7.88 34.38,5 34.38,3.87 U$6.14
N$69  (via drill 0.2)
  Top 0.254: S32.P$2 34.17,7.95 v34.38,7.75
  Bottom 0.254: v34.38,7.75 34.38,9.13 U$6.11
N$70  (via drill 0.2)
  Top 0.254: v29.75,10.25 30.38,9.62 33.38,9.62 35.12,7.88 37.25,7.88 S33.P$1
  Bottom 0.254: v29.75,10.25 29.25,9.75 29.25,9.25 U$6.3
N$71  (via drill 0.2)
  Top 0.254: v36,11.62 39.62,8 39.69,8 S33.P$2
  Bottom 0.254: v36,11.62 34.5,10.12 34,10.12 33.75,9.88 33.75,9.21 U$6.10
N$72  (via drill 0.2)
  Top 0.254: S34.P$1 23.26,1.64 v26.38,4.75
  Bottom 0.254: v26.38,4.75 26.5,4.75 29.88,8.12 U$6.4
N$73  (via drill 0.2)
  Top 0.254: S34.P$2 26.95,0.95 v27,1
  Bottom 0.254: v27,1 27.62,1 29.25,2.62 29.25,3.79 U$6.22
N$74  (via drill 0.2)
  Top 0.254: S35.P$1 30.26,6.26 30.75,6.75 33.38,6.75 v33.5,6.88
  Bottom 0.254: v33.5,6.88 33.5,7.62 33.12,8 U$6.9
N$75  (via drill 0.2)
  Top 0.254: S35.P$2 33.7,0.95 v33.75,1.12
  Bottom 0.254: v33.75,1.12 33.75,3.72 U$6.15
N$76  (via drill 0.2)
  Top 0.254: S36.P$1 35.67,0.95 34.75,1.88 33.12,1.88 32.5,2.5 v32.5,5
  Bottom 0.254: v32.5,5 32.5,3.85 U$6.17
N$77  (via drill 0.2)
  Top 0.254: S36.P$2 39.55,0.95 34.75,5.75 32.12,5.75 v31.88,5.5
  Bottom 0.254: v31.88,5.5 31.88,3.9 U$6.18
N$90
  Bottom 0.254: U$5.7 10.88,9.25 10.88,10.5 11.38,11 18.62,11 19.88,9.75 22.38,9.75 23.62,11 28.12,11 28.25,11.12 29.75,11.12 30.5,10.38 30.5,9.21 U$6.5
SCK  (via drill 0.2, 0.2 pad 0.1)
  Top 0.254: 21.25,43.81 U$15.P$4 21.25,41.38 21.75,40.88 v21.75,40.12 21.75,40 21.38,39.62 21.38,37.38 19.12,35.12 15.88,35.12 15.5,35.5 15.5,35.62 14.38,36.75 11.38,36.75 10.88,36.25 10.88,35.75 v10,34.88 | U$16.P$4 41.12,20.75 41,20.62 v38.88,20.62 38.88,21.5 36,24.38 v35.62,24.38 | v9.12,19.75 v7.62,21.25 | v26.62,6 28.38,4.25 29,4.25 v29.62,4.88 29.62,7.38 29.12,7.88 v29.12,14.62 | v8.62,5.5 5.62,8.5 5.62,9 6,9.38 13.62,9.38 16,7 17.12,7 | v18.88,7 17.12,7 | v10.62,18.88 10.62,14.88 14.25,11.25 15,11.25 17.12,9.12 17.12,7 | v26.75,35.62 v29.5,32.88 29.38,32.88 29.38,28.62 v31.5,26.5 | v31.88,16.75 31.88,19.38 v31.75,19.5
  Bottom 0.254: v38.88,20.62 38.75,20.75 X4.4 36.62,20.75 36.38,20.5 32.88,20.5 32,19.62 31.75,19.62 | v21.75,40.12 21.25,39.62 X3.4 21.25,36.62 21.5,36.38 26,36.38 v26.75,35.62 | X2.3 7.12,20.75 v7.62,21.25 | v9.12,19.75 10.12,18.75 10.5,18.75 | 10.5,18.75 10.88,18.38 10.88,17.88 U$3.20 | v29.62,4.88 29.75,4.75 30.12,4.75 30.5,4.38 30.5,3.88 U$6.20 | v8.62,5.5 9.5,5.5 9.5,3.88 U$5.20 | v10.62,18.88 10.62,18.75 10.5,18.75 | 31.75,19.62 29.25,19.62 29.25,17.88 U$4.20 | v10,34.88 9.62,34.88 9.62,32.62 9.5,32.5 9.5,31.84 U$1.20 | v29.5,32.88 30.5,32.88 30.5,31.88 U$2.20 | v35.62,24.38 33.5,26.5 v31.5,26.5 | v29.12,14.62 31.25,16.75 v31.88,16.75 | v31.75,19.5 31.75,19.62 | v18.88,7 20.62,7 | 20.62,7 21.25,6.38 X1.3 | v26.62,6 23.38,6 22.38,7 20.62,7
SIN  (via drill 0.2)
  Top 0.254: v10.12,28.62 10.12,29.5 9,30.62 v9,34.12 | v20.75,4 20.75,4.75 21.88,5.88 21.88,9.75 22.62,10.5 22.62,11.75 21.5,12.88 v21.5,13.62 | v19.62,13.75 19.62,17.25 15.38,21.5 15.38,22 13.75,23.62 v6.25,23.62
  Bottom 0.254: X2.4 4.38,21.25 4.12,21.5 4.12,22.5 4.5,22.88 5.5,22.88 v6.25,23.62 6.25,24.75 v10.12,28.62 | v9,34.12 9,35.62 9.5,36.12 9.5,37.12 U$1.5 | v20.75,4 X1.4 | v21.5,13.62 21.38,13.75 v19.62,13.75
SOUT  (via drill 0.2, 0.2 pad 0.1)
  Top 0.254: v21,40.25 21,41 20.75,41.25 U$15.P$3 20.75,43.81 | v40.5,21.25 U$16.P$3 | v32,10.25 35.25,13.5 39.5,13.5 40.62,14.62 40.62,16.5 v36,21.12
  Bottom 0.254: v40.5,21.25 X4.3 36.12,21.25 | v21,40.25 20.75,40 X3.3 20.75,36 21.88,34.88 21.88,26.25 22.38,25.75 32.75,25.75 35.38,23.12 35.38,21.88 35.88,21.38 36.12,21.38 36.12,21.25 | 31.88,10.25 v32,10.25 31.88,10.12 31.88,9.25 31.82,9.2 U$6.7 | 36.12,21.25 v36,21.12
V+  (via drill 0.2, 0.2 pad 0.1)
  Top 0.254: v19.25,38.25 19.25,39.38 | 19.25,39.38 19.25,40.88 19.75,41.38 U$15.P$1 19.75,43.81 | U$16.P$1 41.62,22.25 v41,22.88 | v31.25,22.12 v33.5,19.88 34.94,18.44 | 34.94,18.44 v38.62,14.75 | v36,22.25 36,22 35,21 35,18.5 34.94,18.44 | v19.38,6.25 19.38,6.62 19.62,6.88 19.62,12.75 15.62,16.75 v13.5,16.75 | v8.62,2.12 6.88,2.12 1.38,7.62 1.38,8.25 4.56,11.44 | 4.56,11.44 v7.5,14.38 7.5,14.5 3.88,18.12 3.88,22.25 4.5,22.88 6.38,22.88 v6.5,23 | 19.25,39.38 4.5,39.38 0.88,35.75 0.88,15.12 4.56,11.44 | v12.75,27.62 v22.5,27.62
  Bottom 0.254: X4.1 37.88,22.25 38.5,22.88 v41,22.88 | v19.25,38.25 19.25,37.65 X3.1 | U$1.16 12.12,30.75 11.88,30.5 10.75,30.5 | 10.75,30.5 9.25,30.5 8.88,30.88 U$1.21 | U$3.21 10.25,16.75 10.31,16.69 | 10.31,16.69 10.5,16.5 13.12,16.5 13.44,16.81 | 13.44,16.81 13.5,16.88 U$3.16 | 29.88,29.88 U$2.21 | 32.5,29.88 32.75,29.88 33.12,30.25 U$2.16 | 32.5,29.88 29.88,29.88 | X4.1 37.12,22.38 37.12,23.75 32.75,28.12 32.75,29.62 32.5,29.88 | U$6.21 29.88,2.88 32.75,2.88 | 32.75,2.88 33.12,3.25 U$6.16 | U$4.21 28.62,20.75 29.88,20.75 v31.25,22.12 | v33.5,19.88 33.25,19.62 32.88,19.62 31.88,18.62 U$4.16 | 32.75,2.88 32.75,0.5 36.12,0.5 40.25,4.62 40.25,14.25 39.75,14.75 v38.62,14.75 | v36,22.25 36.88,22.25 37,22.38 X4.1 | 10.75,30.5 10.75,27.62 | 10.75,27.62 10.75,27.25 v6.5,23 5.75,22.25 X2.6 | 8.88,2.12 U$5.21 | 8.88,2.12 11,2.12 12.12,3.25 U$5.16 | v13.5,16.75 13.44,16.81 | v7.5,14.38 7.62,14.5 8.12,14.5 10.31,16.69 | v8.62,2.12 8.88,2.12 | v22.5,27.62 27.5,27.62 29.75,29.88 29.88,29.88 | 10.75,27.62 v12.75,27.62 | X1.6 19.75,5.88 v19.38,6.25

### Text on the board
tNames: V+ | 5V | SO | SCK | CS | GND | 5V | V+ | SCK | SO | CS | GND
bNames: TappyTap 6x6 Rev 2. 04.02.19 | V+ | 5V | SO | SCK | CS | GND | V+ | 5V | SO | SCK | CS | GND